# Altium project rtm-lamp.PrjPcb (part 5 of 6)

## Sheet power-amplifiers.SchDoc: Power Amplifiers
size A3; DrawnBy: Augusto Fraga Giachero; DocumentNumber: 5; SheetNumber: 5; SheetTotal: 9
Used 12 times, as channels CH11, CH10, CH9, CH8, CH0, CH1, CH2, CH3, CH4, CH5, CH6, CH7. Parts and nets are listed once, with the designators drawn on the sheet.
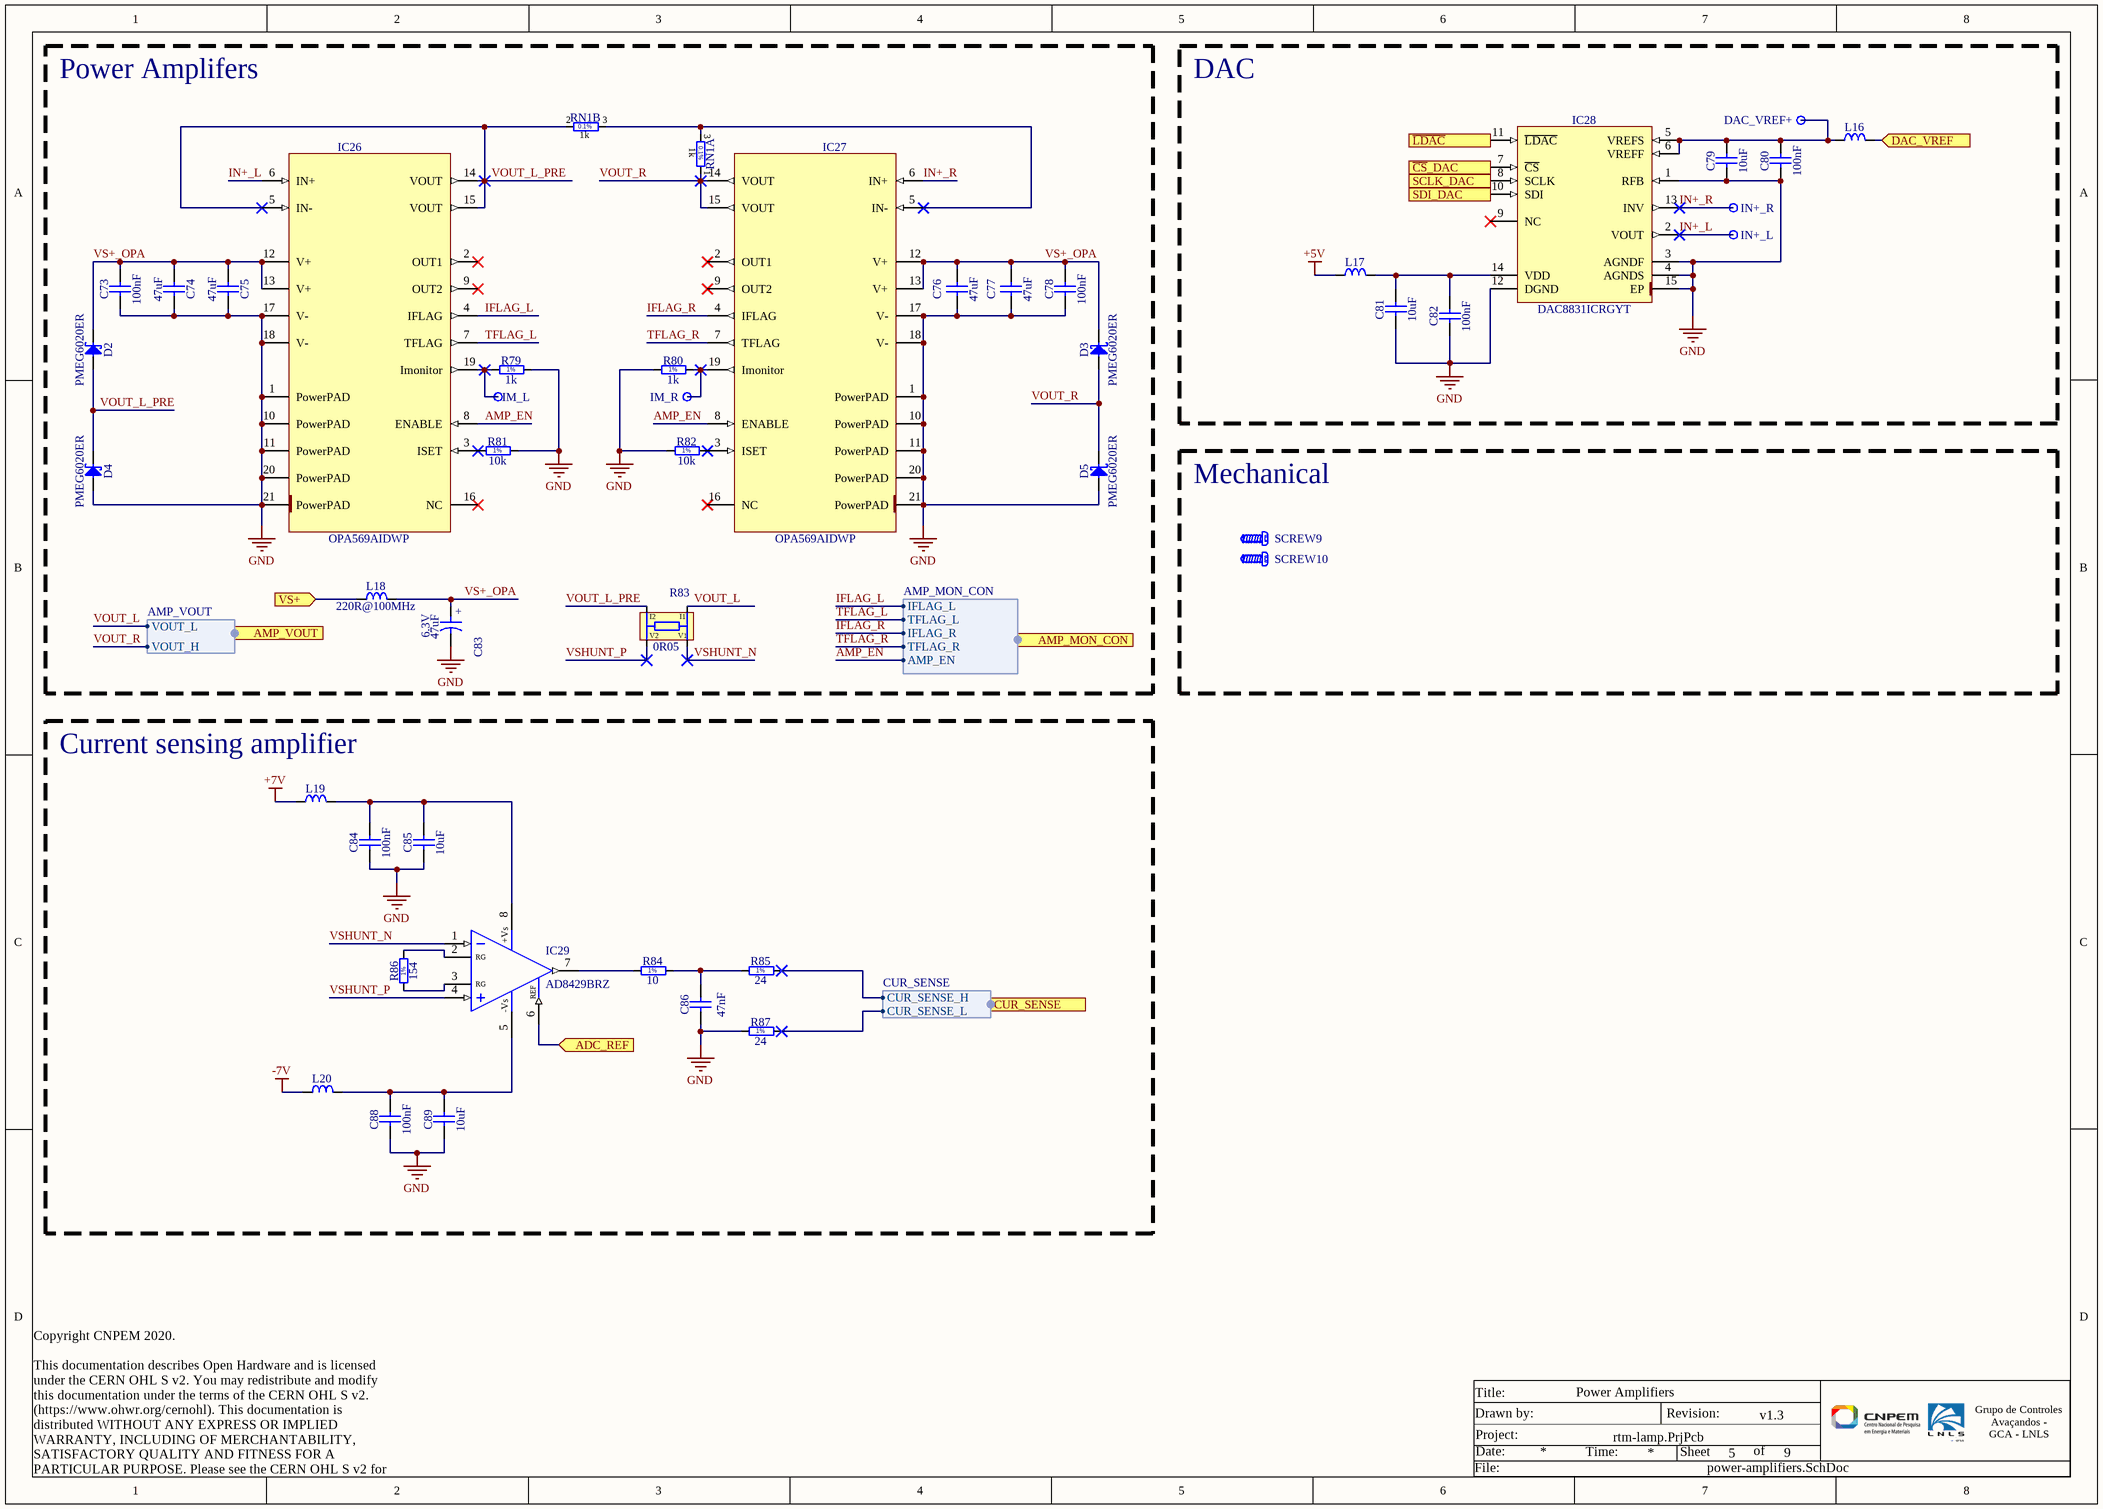
[diagram p6: power-amplifiers.SchDoc]

### Parts
C73  100nF  [CAPC1005X55N]
C74  47uF  [CAPC2012X140N]
C75  47uF  [CAPC2012X140N]
C76  47uF  [CAPC2012X140N]
C77  47uF  [CAPC2012X140N]
C78  100nF  [CAPC1005X55N]
C79  10uF  [CAPC2012X95N]
C80  100nF  [CAPC1005X55N]
C81  10uF  [CAPC2012X95N]
C82  100nF  [CAPC1005X55N]
C83  47uF  Voltage: 6.3V  [CAPMP3528X210N]
C84  100nF  [CAPC1608X87N]
C85  10uF  [CAPC2012X95N]
C86  47nF  [CAPC2012X135N]
C88  100nF  [CAPC1608X87N]
C89  10uF  [CAPC2012X95N]
D2  PMEG6020ER  [SODFL3517X110N]
D3  PMEG6020ER  [SODFL3517X110N]
D4  PMEG6020ER  [SODFL3517X110N]
D5  PMEG6020ER  [SODFL3517X110N]
DAC_VREF+  Test Point  [TPS127]  (value not drawn)
IC26  OPA569AIDWP  [SOIC127P1030X265-21N-R381X432-TB]
IC27  OPA569AIDWP  [SOIC127P1030X265-21N-R381X432-TB]
IC28  DAC8831ICRGYT  [TEXAS_RGY (S-PVQFN–N14) Simple]
IC29  AD8429BRZ  [SOIC127P600X175-8N]
IM_L  Test Point  [TPS127]  (value not drawn)
IM_R  Test Point  [TPS127]  (value not drawn)
IN+_L  Test Point  [TPS127]  (value not drawn)
IN+_R  Test Point  [TPS127]  (value not drawn)
L16  1K@100MHz  [INDC1608X95N]  (value not drawn)
L17  1K@100MHz  [INDC1608X95N]  (value not drawn)
L18  220R@100MHz  [INDC2012X105N]
L19  1K@100MHz  [INDC1608X95N]  (value not drawn)
L20  1K@100MHz  [INDC1608X95N]  (value not drawn)
R79  1k  [RESC1005X40N]
R80  1k  [RESC1005X40N]
R81  10k  [RESC1005X40N]
R82  10k  [RESC1005X40N]
R83  0R05  [RES_VISHAY_WSK1206]
R84  10  [RESC1005X40N]
R85  24  [RESC1005X40N]
R86  154  [RESC1608X55N]
R87  24  [RESC1005X40N]
RN1  1k 1k  [SOT95P230X112-3N]  (value not drawn)  (parts A,B of 2)
SCREW9  M2x6  [MCMASTERCARR_90910A922_V]  (value not drawn)
SCREW10  M2x6  [MCMASTERCARR_90910A922_V]  (value not drawn)

### Blocks framed on the sheet
Power Amplifers: C73-C78 C83 D2-D5 IC26 IC27 IM_L IM_R L18 R79-R83 RN1
DAC: C79-C82 DAC_VREF+ IC28 IN+_L IN+_R L16 L17
Mechanical: SCREW9 SCREW10
Current sensing amplifier: C84-C86 C88 C89 IC29 L19 L20 R84-R87

### Ports
ADC_REF (in), AMP_MON_CON (harness AMP_MON_CON), AMP_VOUT (harness AMP_VOUT), CUR_SENSE (harness CUR_SENSE), DAC_VREF (in), SCLK_DAC (in), SDI_DAC (in), VS+ (in), ~{CS}_DAC (in), ~{LDAC} (in)

### Harnesses
AMP_MON_CON: IFLAG_L, TFLAG_L, IFLAG_R, TFLAG_R, AMP_EN
AMP_VOUT: VOUT_L, VOUT_H
CUR_SENSE: CUR_SENSE_H, CUR_SENSE_L

### Nets
+5V: L17.1
+7V: L19.1
-7V: L20.1
GND: C73.1 C74.1 C75.1 C76.1 C77.1 C78.1 C79.1 C80.1 C81.1 C82.1 C83.2 C84.1 C85.1 C86.1 C88.1 C89.1 D4.2(A) D5.2(A) IC26.1(PowerPAD) IC26.10(PowerPAD) IC26.11(PowerPAD) IC26.17(V-) IC26.18(V-) IC26.20(PowerPAD) IC26.21(PowerPAD) IC27.1(PowerPAD) IC27.10(PowerPAD) IC27.11(PowerPAD) IC27.17(V-) IC27.18(V-) IC27.20(PowerPAD) IC27.21(PowerPAD) IC28.1(RFB) IC28.3(AGNDF) IC28.4(AGNDS) IC28.12(DGND) IC28.15(EP) R79.2 R80.1 R81.2 R82.1 R87.1
ADC_REF: IC29.6(REF) ; port ADC_REF
AMP_EN: IC26.8(ENABLE) IC27.8(ENABLE) ; port AMP_MON_CON.AMP_EN
~{CS}_DAC: IC28.7(~{CS}) ; port ~{CS}_DAC
DAC_VREF: L16.2 ; port DAC_VREF
IFLAG_L: IC26.4(IFLAG) ; port AMP_MON_CON.IFLAG_L
IFLAG_R: IC27.4(IFLAG) ; port AMP_MON_CON.IFLAG_R
IN+_L: IC26.6(IN+) IC28.2(VOUT) IN+_L.1
IN+_R: IC27.6(IN+) IC28.13(INV) IN+_R.1
~{LDAC}: IC28.11(~{LDAC}) ; port ~{LDAC}
SCLK_DAC: IC28.8(SCLK) ; port SCLK_DAC
SDI_DAC: IC28.10(SDI) ; port SDI_DAC
TFLAG_L: IC26.7(TFLAG) ; port AMP_MON_CON.TFLAG_L
TFLAG_R: IC27.7(TFLAG) ; port AMP_MON_CON.TFLAG_R
VOUT_L: R83.I1 ; port AMP_VOUT.VOUT_L
VOUT_L_PRE: D2.2(A) D4.1(C) IC26.5(IN-) IC26.14(VOUT) IC26.15(VOUT) R83.I2 RN1.2
VOUT_R: D3.2(A) D5.1(C) IC27.14(VOUT) IC27.15(VOUT) RN1.1 ; port AMP_VOUT.VOUT_H
VS+: L18.1 ; port VS+
VS+_OPA: C73.2 C74.2 C75.2 C76.2 C77.2 C78.2 C83.1 D2.1(C) D3.1(C) IC26.12(V+) IC26.13(V+) IC27.12(V+) IC27.13(V+) L18.2
VSHUNT_N: IC29.1(-IN) R83.V1
VSHUNT_P: IC29.4(+IN) R83.V2
NetC79_2: C79.2 C80.2 DAC_VREF+.1 IC28.5(VREFS) IC28.6(VREFF) L16.1
NetC81_2: C81.2 C82.2 IC28.14(VDD) L17.2
NetC84_2: C84.2 C85.2 IC29.8(+Vs) L19.2
NetC86_2: C86.2 R84.2 R85.1
NetC88_2: C88.2 C89.2 IC29.5(-Vs) L20.2
NetIC26_3: IC26.3(ISET) R81.1
NetIC26_19: IC26.19(Imonitor) IM_L.1 R79.1
NetIC27_3: IC27.3(ISET) R82.2
NetIC27_5: IC27.5(IN-) RN1.3
NetIC27_19: IC27.19(Imonitor) IM_R.1 R80.2
NetIC29_2: IC29.2(RG) R86.2
NetIC29_3: IC29.3(RG) R86.1
NetIC29_7: IC29.7(Vout) R84.1
NetR85_2: R85.2 ; port CUR_SENSE.CUR_SENSE_H
NetR87_2: R87.2 ; port CUR_SENSE.CUR_SENSE_L

Not connected (* = marked no-connect by the designer): IC26 2(OUT1)* 9(OUT2)* 16(NC)*; IC27 2(OUT1)* 9(OUT2)* 16(NC)*; IC28 9(NC)*

### Channels
CH11: designators end in _CH11; ports ADC_REF=ADC_REF_CH8-CH11 DAC_VREF=DAC_REF_CH8-CH11 SCLK_DAC=CLK_DAC_B2 SDI_DAC=SDI_DAC_CH11 VS+=+VS2 ~{CS}_DAC=~{CS_DAC_B2} ~{LDAC}=~{LDAC_B2}
CH10: designators end in _CH10; ports ADC_REF=ADC_REF_CH8-CH11 DAC_VREF=DAC_REF_CH8-CH11 SCLK_DAC=CLK_DAC_B2 SDI_DAC=SDI_DAC_CH10 VS+=+VS2 ~{CS}_DAC=~{CS_DAC_B2} ~{LDAC}=~{LDAC_B2}
CH9: designators end in _CH9; ports ADC_REF=ADC_REF_CH8-CH11 DAC_VREF=DAC_REF_CH8-CH11 SCLK_DAC=CLK_DAC_B2 SDI_DAC=SDI_DAC_CH9 VS+=+VS2 ~{CS}_DAC=~{CS_DAC_B2} ~{LDAC}=~{LDAC_B2}
CH8: designators end in _CH8; ports ADC_REF=ADC_REF_CH8-CH11 DAC_VREF=DAC_REF_CH8-CH11 SCLK_DAC=CLK_DAC_B2 SDI_DAC=SDI_DAC_CH8 VS+=+VS2 ~{CS}_DAC=~{CS_DAC_B2} ~{LDAC}=~{LDAC_B2}
CH0: designators end in _CH0; ports ADC_REF=ADC_REF_CH0-CH7 DAC_VREF=DAC_REF_CH0-CH7 SCLK_DAC=CLK_DAC_B0 SDI_DAC=SDI_DAC_CH0 VS+=+VS1 ~{CS}_DAC=~{CS_DAC_B0} ~{LDAC}=~{LDAC_B0}
CH1: designators end in _CH1; ports ADC_REF=ADC_REF_CH0-CH7 DAC_VREF=DAC_REF_CH0-CH7 SCLK_DAC=CLK_DAC_B0 SDI_DAC=SDI_DAC_CH1 VS+=+VS1 ~{CS}_DAC=~{CS_DAC_B0} ~{LDAC}=~{LDAC_B0}
CH2: designators end in _CH2; ports ADC_REF=ADC_REF_CH0-CH7 DAC_VREF=DAC_REF_CH0-CH7 SCLK_DAC=CLK_DAC_B0 SDI_DAC=SDI_DAC_CH2 VS+=+VS1 ~{CS}_DAC=~{CS_DAC_B0} ~{LDAC}=~{LDAC_B0}
CH3: designators end in _CH3; ports ADC_REF=ADC_REF_CH0-CH7 DAC_VREF=DAC_REF_CH0-CH7 SCLK_DAC=CLK_DAC_B0 SDI_DAC=SDI_DAC_CH3 VS+=+VS1 ~{CS}_DAC=~{CS_DAC_B0} ~{LDAC}=~{LDAC_B0}
CH4: designators end in _CH4; ports ADC_REF=ADC_REF_CH0-CH7 DAC_VREF=DAC_REF_CH0-CH7 SCLK_DAC=CLK_DAC_B1 SDI_DAC=SDI_DAC_CH4 VS+=+VS1 ~{CS}_DAC=~{CS_DAC_B1} ~{LDAC}=~{LDAC_B1}
CH5: designators end in _CH5; ports ADC_REF=ADC_REF_CH0-CH7 DAC_VREF=DAC_REF_CH0-CH7 SCLK_DAC=CLK_DAC_B1 SDI_DAC=SDI_DAC_CH5 VS+=+VS1 ~{CS}_DAC=~{CS_DAC_B1} ~{LDAC}=~{LDAC_B1}
CH6: designators end in _CH6; ports ADC_REF=ADC_REF_CH0-CH7 DAC_VREF=DAC_REF_CH0-CH7 SCLK_DAC=CLK_DAC_B1 SDI_DAC=SDI_DAC_CH6 VS+=+VS1 ~{CS}_DAC=~{CS_DAC_B1} ~{LDAC}=~{LDAC_B1}
CH7: designators end in _CH7; ports ADC_REF=ADC_REF_CH0-CH7 DAC_VREF=DAC_REF_CH0-CH7 SCLK_DAC=CLK_DAC_B1 SDI_DAC=SDI_DAC_CH7 VS+=+VS1 ~{CS}_DAC=~{CS_DAC_B1} ~{LDAC}=~{LDAC_B1}

### Notes on the sheet
- Title:
- Date:
- Project:
- Drawn by:
- Time:
- Revision:
- Sheet
- of
- Grupo de Controles Avaçandos -
  GCA - LNLS
- Copyright CNPEM 2020.
  This documentation describes Open Hardware and is licensed under the CERN OHL S v2. You may redistribute and modify this documentation under the terms of the CERN OHL S v2. (https://www.ohwr.org/cernohl). This documentation is distributed WITHOUT ANY EXPRESS OR IMPLIED WARRANTY, INCLUDING OF MERCHANTABILITY, SATISFACTORY QUALITY AND FITNESS FOR A PARTICULAR PURPOSE. Please see the CERN OHL S v2 for applicable conditions.
- File:
- (in symbol CTE3528-21_47UF_6.3V_10%_LESR0250) +
- (in symbol MPM2001AT1, part A) 1k; 0.1%
- (in symbol MPM2001AT1, part B) 0.1%; 1k
- (in symbol R0402_1K_1%_0.0625W_100PPM) 1%
- (in symbol R0402_10K_1%_0.0625W_100PPM) 1%
- (in symbol R0402_10R_1%_0.0625W_200PPM) 1%
- (in symbol R0402_24R_1%_0.0625W_100PPM) 1%
- (in symbol R0603_154R_1%_0.063W_10PPM) 1%

### Library data of the parts
C73 C78 C80 C82 = CC0402_100NF_16V_10%_X7R: SMD Multilayer Chip Ceramic Capacitor; Manufacturer: GENERIC; Manufacturer1 Part Number: GRM155R71C104KA88D; Voltage: 16V; TC: X7R; Tolerance: ±10%; Part Number: CC0402_100NF_16V_10%_X7R; Component Kind: Standard; Component Type: Standard; Pin Count: 2; Value: 100nF; Status: Not Recommended; Manufacturer Part Number: CC0402_100NF_16V_10%_X7R; Case: 0402; Mounted: Yes; Socket: No; SMD: Yes; Sense: No; Manufacturer1 Example: MURATA; Manufacturer1 ComponentHeight: 0.55mm; HelpURL: \\cern.ch\dfs\Applications\Altium\Datasheets\CC0402_X7R_MURATA_GRM.pdf; Author: CERN DEM JLC; CreateDate: 05/12/2013; LatestRevisionDate: 03/12/2007
C74-C77 = CC0805_47UF_6.3V_20%_X5R: SMD Multilayer Chip Ceramic Capacitor; Manufacturer: GENERIC; Manufacturer1 Part Number: C0805C476M9PACTU; Voltage: 6.3V; TC: X5R; Tolerance: ±20%; Part Number: CC0805_47UF_6.3V_20%_X5R; Component Kind: Standard; Component Type: Standard; Pin Count: 2; Value: 47uF; Status: Preferred; Manufacturer Part Number: CC0805_47UF_6.3V_20%_X5R; Case: 0805; Mounted: Yes; Socket: No; SMD: Yes; Sense: No; Manufacturer1 Example: KEMET; Manufacturer1 ComponentHeight: 1.4mm; HelpURL: \\cern.ch\dfs\Applications\Altium\Datasheets\CC0805_X5R_KEMET.pdf; Author: CERN DEM JLC; CreateDate: 16/10/2012; LatestRevisionDate: 16/10/2012
C79 C81 C85 C89 = CC0805_10UF_25V_10%_X5R: SMD Multilayer Chip Ceramic Capacitor; Manufacturer: GENERIC; Manufacturer1 Part Number: GRM219R61E106KA12D; Voltage: 25V; TC: X5R; Tolerance: ±10%; Part Number: CC0805_10UF_25V_10%_X5R; Component Kind: Standard; Component Type: Standard; Pin Count: 2; Value: 10uF; Status: Preferred; Manufacturer Part Number: CC0805_10UF_25V_10%_X5R; Case: 0805; Mounted: Yes; Socket: No; SMD: Yes; Sense: No; Manufacturer1 Example: MURATA; Manufacturer1 ComponentHeight: 0.95mm; HelpURL: \\cern.ch\dfs\Applications\Altium\Datasheets\CC0805_X5R_MURATA_GRM.pdf; Author: CERN DEM JLC; CreateDate: 25/10/2012; LatestRevisionDate: 06/09/2016
C83 = CTE3528-21_47UF_6.3V_10%_LESR0250: Low ESR 0R25 Solid Tantalum Chip Capacitor; Manufacturer: GENERIC; Manufacturer1 Part Number: TPSB476K006R0250; Tolerance: ±10%; Part Number: CTE3528-21_47UF_6.3V_10%_LESR0250; Component Kind: Standard; Component Type: Standard; Pin Count: 2; Value: 47uF; Status: Preferred; Manufacturer Part Number: CTE3528-21_47UF_6.3V_10%_LESR0250; Case: B; Mounted: Yes; Socket: No; SMD: Yes; Sense: No; Manufacturer1 Example: AVX; Manufacturer1 ComponentHeight: 2.1mm; HelpURL: \\cern.ch\dfs\Applications\Altium\Datasheets\CTE-LESR_AVX_TPS.pdf; Author: CERN DEM JLC; CreateDate: 05/05/2008; LatestRevisionDate: 20/01/2009
C84 C88 = CC0603_100NF_50V_10%_X7R: SMD Multilayer Chip Ceramic Capacitor; Manufacturer: GENERIC; Manufacturer1 Part Number: 223858615649; Voltage: 50V; TC: X7R; Tolerance: ±10%; Part Number: CC0603_100NF_50V_10%_X7R; Component Kind: Standard; Component Type: Standard; Pin Count: 2; Value: 100nF; Status: Preferred; Manufacturer Part Number: CC0603_100NF_50V_10%_X7R; Case: 0603; Mounted: Yes; Socket: No; SMD: Yes; Sense: No; Manufacturer1 Example: PHYCOMP; Manufacturer1 ComponentHeight: 0.87mm; HelpURL: \\cern.ch\dfs\Applications\Altium\Datasheets\CC0603_X7R_PHYCOMP.pdf; Author: CERN DEM JLC; CreateDate: 03/12/2007; LatestRevisionDate: 03/12/2007
C86 = CC0805_47NF_25V_5%_C0G_KEMET_C0805X473J3GECAUTO: SMD Multilayer Chip Ceramic Capacitor, C0G dielectric, Flexible termination; Manufacturer: KEMET; Voltage: 25V; Tolerance: ±5%; Part Number: CC0805_47NF_25V_5%_C0G_KEMET_C0805X473J3GECAUTO; Component Kind: Standard; Component Type: Standard; Pin Count: 2; Value: 47nF; Status: None; TC: C0G; Manufacturer Part Number: C0805X473J3GECAUTO; Case: 0805; Mounted: Yes; Socket: No; SMD: Yes; Sense: No; ComponentHeight: 1.25mm; Author: LNLS DIG AFG; CreateDate: 16/10/2020; LatestRevisionDate: 16/10/2020
D2-D5 = PMEG6020ER: MEGA Schottky Barrier Rectifier; Manufacturer: NXP SEMICONDUCTORS; Voltage: 60V; Power: 2A; PressFit: No; Bonding: No; Part Number: PMEG6020ER; Component Kind: Standard; Component Type: Standard; Device: PMEG6020ER; PackageDescription: SODFL Diode (SOD123W); 2.60mm W X 1.70mm L X 1.10mm H body, IPC Medium Density; Manufacturer Part Number: PMEG6020ER; Pin Count: 2; Case: SOD123; Mounted: Yes; Socket: No; SMD: Yes; Sense: No; ComponentHeight: 0.65mm; HelpURL: \\cern.ch\dfs\Applications\Altium\Datasheets\PMEG6020ER.pdf; Author: CERN DEM JMW; CreateDate: 19/06/2014; LatestRevisionDate: 19/06/2014
DAC_VREF+ IM_L IM_R IN+_L IN+_R = SMD_PAD_1.27X1.27MM: 1.27mm x 1.27mm PCB Copper Area (SMD Test Point); Mounted: No; Part Number: SMD_PAD_1.27X1.27MM; Component Kind: Standard (No BOM); Component Type: Standard (No BOM); Pin Count: 1; Family: Test Point; Socket: No; SMD: Yes; Sense: No; Status: None; ComponentHeight: 0mm; HelpURL: Undefined; Author: CERN DEM JLC; CreateDate: 12/01/2008; LatestRevisionDate: 12/01/2008; PackageDescription: 1.27mm x 1.27mm PCB Copper Area (SMD Test Point)
IC26 IC27 = OPA569AIDWP_HEATSINK: Rail-to-Rail I/O, 2A, Power amplifier; Manufacturer: TEXAS INSTRUMENTS; PressFit: No; Bonding: No; Part Number: OPA569AIDWP_HEATSINK; Component Kind: Standard; Component Type: Standard; Device: OPA569AIDWP; PackageDescription: SOIC 20, Pitch 1.27mm - Body 7.5x12.9mm, (w/thermal tab 3.81mm X 4.32mm), IPC Medium Density; Manufacturer Part Number: OPA569AIDWP; Pin Count: 21; Case: SOIC20; Mounted: Yes; Socket: No; SMD: Yes; Sense: No; ComponentHeight: 2.65mm; Author: LNLS DIG AFG; CreateDate: 12/07/2020; LatestRevisionDate: 12/07/2020
IC28 = DAC8831ICRGYT: 16-Bit, Ultra-Low Power, Voltage-Output Digital-to-Analog Converter; Manufacturer: TEXAS INSTRUMENTS; PressFit: No; Bonding: No; Part Number: DAC8831ICRGYT; Component Kind: Standard; Component Type: Standard; Device: DAC8831ICRGYT; Footprint: TEXAS_RGY (S-PVQFN–N14); PackageDescription: TEXAS Case Style RGY (S-PVQFN-N14), QFN, 0.50mm Pitch, Square; 14 Pin, 3.5mm L X 3.5mm W X 1.00mm H body (w/thermal tab 2.15 X 2.15mm); Manufacturer Part Number: DAC8831ICRGYT; Pin Count: 15; Case: QFN14; Mounted: Yes; Socket: No; SMD: Yes; Sense: No; ComponentHeight: 1mm; Author: LNLS DIG LOS; CreateDate: 13/06/2018; LatestRevisionDate: 20/12/2021
IC29 = AD8429BRZ: 1nV/sqrt Hz Low Noise Instrumentation Amplifier; Manufacturer: ANALOG DEVICES; PressFit: No; Bonding: No; Part Number: AD8429BRZ; Component Kind: Standard; Component Type: Standard; Device: AD8429BRZ; PackageDescription: SOIC 8, Pitch 1.27mm - Body 4x5mm, IPC Medium Density; Manufacturer Part Number: AD8429BRZ; Pin Count: 8; Case: SOIC8; Mounted: Yes; Socket: No; SMD: Yes; Sense: No; ComponentHeight: 1.75mm; Author: CERN DEM JLC; HelpURL: \\cern.ch\dfs\Applications\Altium\Datasheets\AD8429BRZ.pdf; CreateDate: 31/08/2011; LatestRevisionDate: 31/08/2011
L16 L17 L19 L20 = IND0603_MURATA_BLM18AG102SN1D: SMD EMIFIL Suppression Chip Ferrite Bead; Manufacturer: MURATA; Power: 400mA; Resistance: 0.50R; Tolerance: ±25%; Part Number: IND0603_MURATA_BLM18AG102SN1D; Component Kind: Standard; Component Type: Standard; Pin Count: 2; Value: 1K@100MHz; Status: None; Manufacturer Part Number: BLM18AG102SN1D; Case: 0603; Mounted: Yes; Socket: No; SMD: Yes; Sense: No; ComponentHeight: 0.95mm; Author: LNLS DIG GBMB; CreateDate: 03/11/2017; LatestRevisionDate: 03/11/2017
L18 = IND0805_MURATA_BLM21PG221SN1D: SMD EMIFIL Suppression Chip Ferrite Bead; Manufacturer: MURATA; Power: 2A; Resistance: 0.05R; Tolerance: ±25%; Part Number: IND0805_MURATA_BLM21PG221SN1D; Component Kind: Standard; Component Type: Standard; Pin Count: 2; Value: 220R@100MHz; Status: None; Manufacturer Part Number: BLM21PG221SN1D; Case: 0805; Mounted: Yes; Socket: No; SMD: Yes; Sense: No; ComponentHeight: 1.05mm; HelpURL: \\cern.ch\dfs\Applications\Altium\Datasheets\IND0402_MURATA_BLM21P.pdf; Author: CERN DEM JLC; CreateDate: 25/01/2010; LatestRevisionDate: 25/01/2010
R79 R80 = R0402_1K_1%_0.0625W_100PPM: General Purpose Thick Film Chip Resistor; Manufacturer: GENERIC; Manufacturer1 Part Number: 232270671002L; TC: ±100ppm/°C; Tolerance: ±1%; Part Number: R0402_1K_1%_0.0625W_100PPM; Component Kind: Standard; Component Type: Standard; Pin Count: 2; Value: 1k; Status: Not recommended; Power: 0.0625W; Manufacturer Part Number: R0402_1K_1%_0.0625W_100PPM; Case: 0402; Mounted: Yes; Sense: No; Socket: No; SMD: Yes; Manufacturer1 Example: YAGEO PHYCOMP; Manufacturer1 ComponentHeight: 0.4mm; HelpURL: \\cern.ch\dfs\Applications\Altium\Datasheets\R0402_Phycomp_RC0402.pdf; Author: CERN DEM JLC; CreateDate: 03/12/2007; LatestRevisionDate: 17/10/2012
R81 R82 = R0402_10K_1%_0.0625W_100PPM: General Purpose Thick Film Chip Resistor; Manufacturer: GENERIC; Manufacturer1 Part Number: 232270671003L; TC: ±100ppm/°C; Tolerance: ±1%; Part Number: R0402_10K_1%_0.0625W_100PPM; Component Kind: Standard; Component Type: Standard; Pin Count: 2; Value: 10k; Status: Not recommended; Power: 0.0625W; Manufacturer Part Number: R0402_10K_1%_0.0625W_100PPM; Case: 0402; Mounted: Yes; Sense: No; Socket: No; SMD: Yes; Manufacturer1 Example: YAGEO PHYCOMP; Manufacturer1 ComponentHeight: 0.4mm; HelpURL: \\cern.ch\dfs\Applications\Altium\Datasheets\R0402_Phycomp_RC0402.pdf; Author: CERN DEM JLC; CreateDate: 03/12/2007; LatestRevisionDate: 17/10/2012
R83 = R1206_0R05_1%_0.5W_35PPM_VISHAY: Four Terminal Current Sense; Manufacturer: Vishay; Manufacturer Part Number: WSK1206R0500FEA18; Power: 0.5W; TC: ±35ppm/°C; Tolerance: ±1%; Part Number: R1206_0R05_1%_0.5W_35PPM_VISHAY; Component Kind: Standard; Component Type: Standard; Pin Count: 4; Value: 0R05; Status: None; Case: WSK1206; Mounted: Yes; Sense: No; Socket: No; SMD: Yes; ComponentHeight: 0.7mm; Author: LNLS DIG GBMB; CreateDate: 05/11/2018; LatestRevisionDate: 05/11/2018
R84 = R0402_10R_1%_0.0625W_200PPM: General Purpose Thick Film Chip Resistor; Manufacturer: GENERIC; Manufacturer1 Part Number: 232270671009L; TC: ±200ppm/°C; Tolerance: ±1%; Part Number: R0402_10R_1%_0.0625W_200PPM; Component Kind: Standard; Component Type: Standard; Pin Count: 2; Value: 10; Status: Not recommended; Power: 0.0625W; Manufacturer Part Number: R0402_10R_1%_0.0625W_200PPM; Case: 0402; Mounted: Yes; Sense: No; Socket: No; SMD: Yes; Manufacturer1 Example: YAGEO PHYCOMP; Manufacturer1 ComponentHeight: 0.4mm; HelpURL: \\cern.ch\dfs\Applications\Altium\Datasheets\R0402_Phycomp_RC0402.pdf; Author: CERN DEM JLC; CreateDate: 24/06/2009; LatestRevisionDate: 17/10/2012
R85 R87 = R0402_24R_1%_0.0625W_100PPM: General Purpose Thick Film Chip Resistor; Manufacturer: GENERIC; Manufacturer1 Part Number: 232270672409L; TC: ±100ppm/°C; Tolerance: ±1%; Part Number: R0402_24R_1%_0.0625W_100PPM; Component Kind: Standard; Component Type: Standard; Pin Count: 2; Value: 24; Status: Not recommended; Power: 0.0625W; Manufacturer Part Number: R0402_24R_1%_0.0625W_100PPM; Case: 0402; Mounted: Yes; Sense: No; Socket: No; SMD: Yes; Manufacturer1 Example: YAGEO PHYCOMP; Manufacturer1 ComponentHeight: 0.4mm; HelpURL: \\cern.ch\dfs\Applications\Altium\Datasheets\R0402_Phycomp_RC0402.pdf; Author: CERN DEM JLC; CreateDate: 03/12/2007; LatestRevisionDate: 17/10/2012
R86 = R0603_154R_1%_0.063W_10PPM: General Purpose Thick Film Chip Resistor; Manufacturer: GENERIC; Manufacturer Part Number: R0603_154R_1%_0.1W_100PPM; Manufacturer1 Part Number: RC0603FR-07154RL; Power: 0.1W; TC: ±100ppm; Tolerance: ±1%; Part Number: R0603_154R_1%_0.063W_10PPM; Component Kind: Standard; Component Type: Standard; Pin Count: 2; Value: 154; Case: 0603; Mounted: Yes; Sense: No; Socket: No; SMD: Yes; Manufacturer1 Example: YAGEO PHYCOMP; Manufacturer1 ComponentHeight: 0.6mm; Author: LNLS DIG GBMB; CreateDate: 05/11/2018; LatestRevisionDate: 05/11/2018
RN1 = MPM2001AT1: Divider, Thin Film Resistors Network; Manufacturer: VISHAY THIN FILM; Power: 0.1W; TC: ±25ppm/°C; Tolerance: ±0.1%; Voltage: 100V; Part Number: MPM2001AT1; Component Kind: Standard; Component Type: Standard; Pin Count: 3; Value: 1k 1k; Sense: no; Manufacturer Part Number: MPM2001AT1; Case: SOT23-3; Mounted: Yes; Socket: No; SMD: Yes; ComponentHeight: 1.22mm; HelpURL: \\cern.ch\dfs\Applications\Altium\Datasheets\RN_VISHAY_MPM.pdf; Author: LNLS DIG AFG; CreateDate: 11/05/2020; LatestRevisionDate: 11/05/2020
SCREW9 SCREW10 = MCMASTERCARR_90910A922_v: M2 L=6mm Torx Socket Pan Head Screw, Fully Threaded - Stainless Steel; Manufacturer: MCMASTER-CARR; PressFit: No; Part Number: MCMASTERCARR_90910A922_v; Component Kind: Standard; Component Type: Mechanical; Pin Count: 0; PackageDescription: M2 L=6mm Hexalobular Socket Pan Head Screw, Fully Threaded - Stainless Steel; Mounted: Yes; Socket: No; SMD: No; Sense: No; Status: None; Value: M2x6; Manufacturer Part Number: 90910A922; ComponentHeight: 7.1mm; Author: LNLS DIG AFG; CreateDate: 05/08/2020; LatestRevisionDate: 05/08/2020

## Sheet clock-distribution.SchDoc: Clock Distribution
size A3; DrawnBy: Augusto Fraga Giachero; DocumentNumber: 8; SheetNumber: 8; SheetTotal: 9
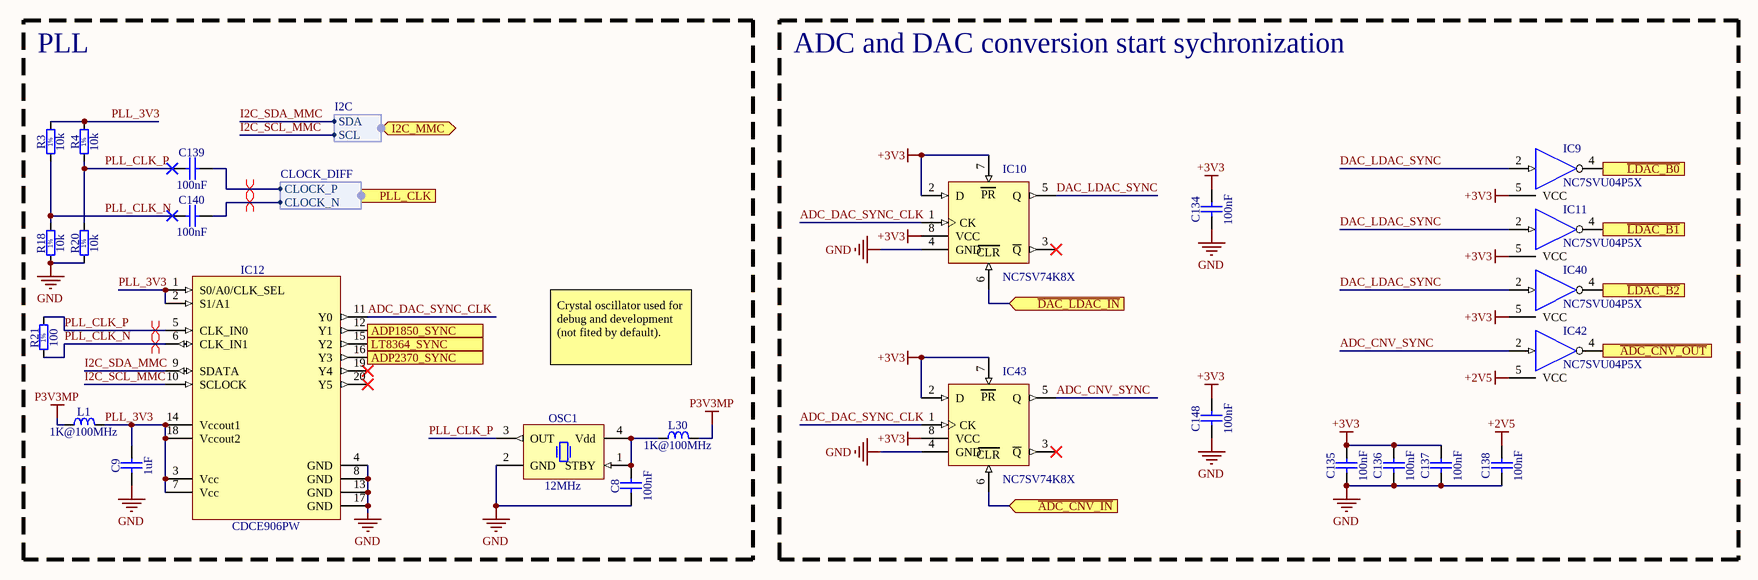
[diagram p7: clock-distribution.SchDoc]

### Parts
C8  100nF  [CAPC1005X55N]
C9  1uF  [CAPC2012X135N]
C134  100nF  [CAPC1005X55N]
C135  100nF  [CAPC1005X55N]
C136  100nF  [CAPC1005X55N]
C137  100nF  [CAPC1005X55N]
C138  100nF  [CAPC1005X55N]
C139  100nF  [CAPC1005X55N]
C140  100nF  [CAPC1005X55N]
C148  100nF  [CAPC1005X55N]
IC9  NC7SVU04P5X  [SOT65P210X110-5N]
IC10  NC7SV74K8X  [SOP50P310X90-8N]
IC11  NC7SVU04P5X  [SOT65P210X110-5N]
IC12  CDCE906PW  [SOP65P640X120-20N]
IC40  NC7SVU04P5X  [SOT65P210X110-5N]
IC42  NC7SVU04P5X  [SOT65P210X110-5N]
IC43  NC7SV74K8X  [SOP50P310X90-8N]
L1  1K@100MHz  [INDC1608X95N]
L30  1K@100MHz  [INDC1608X95N]
OSC1  12MHz  [XTAL_CONNOR_CS_LNLS]
R3  10k  [RESC1005X40N]
R4  10k  [RESC1005X40N]
R18  10k  [RESC1005X40N]
R20  10k  [RESC1005X40N]
R21  100  [RESC1005X40N]

### Blocks framed on the sheet
PLL: C8 C9 C139 C140 IC12 L1 L30 OSC1 R3 R4 R18 R20 R21
ADC and DAC conversion start sychronization: C134-C138 C148 IC9-IC11 IC40 IC42 IC43

### Ports
ADP1850_SYNC (out), ADP2370_SYNC (out), I2C_MMC (bidir, harness I2C), LT8364_SYNC (out), PLL_CLK (harness CLOCK_DIFF), ~{ADC_CNV_IN} (in), ~{ADC_CNV_OUT} (out), ~{DAC_LDAC_IN} (in), ~{LDAC_B0} (out), ~{LDAC_B1} (out), ~{LDAC_B2} (out)

### Harnesses
I2C: SDA, SCL
CLOCK_DIFF: CLOCK_P, CLOCK_N

### Nets
+2V5: C138.2 IC42.5(VCC)
+3V3: C134.2 C135.2 C136.2 C137.2 C148.2 IC9.5(VCC) IC10.2(D) IC10.7(~{PR}) IC10.8(VCC) IC11.5(VCC) IC40.5(VCC) IC43.2(D) IC43.7(~{PR}) IC43.8(VCC)
GND: C8.1 C9.1 C134.1 C135.1 C136.1 C137.1 C138.1 C148.1 IC9.3(GND) IC10.4(GND) IC11.3(GND) IC12.4(GND) IC12.8(GND) IC12.13(GND) IC12.17(GND) IC40.3(GND) IC42.3(GND) IC43.4(GND) OSC1.2(GND) R18.1 R20.1
P3V3MP: L1.1 L30.2
~{ADC_CNV_IN}: IC43.6(~{CLR}) ; port ~{ADC_CNV_IN}
~{ADC_CNV_OUT}: IC42.4(OUT) ; port ~{ADC_CNV_OUT}
ADC_CNV_SYNC: IC42.2(IN) IC43.5(Q)
ADC_DAC_SYNC_CLK: IC10.1(CK) IC12.11(Y0) IC43.1(CK)
ADP1850_SYNC: IC12.12(Y1) ; port ADP1850_SYNC
ADP2370_SYNC: IC12.16(Y3) ; port ADP2370_SYNC
~{DAC_LDAC_IN}: IC10.6(~{CLR}) ; port ~{DAC_LDAC_IN}
DAC_LDAC_SYNC: IC9.2(IN) IC10.5(Q) IC11.2(IN) IC40.2(IN)
I2C_SCL_MMC: IC12.10(SCLOCK) ; port I2C_MMC.SCL
I2C_SDA_MMC: IC12.9(SDATA) ; port I2C_MMC.SDA
~{LDAC_B0}: IC9.4(OUT) ; port ~{LDAC_B0}
~{LDAC_B1}: IC11.4(OUT) ; port ~{LDAC_B1}
~{LDAC_B2}: IC40.4(OUT) ; port ~{LDAC_B2}
LT8364_SYNC: IC12.15(Y2) ; port LT8364_SYNC
PLL_3V3: C9.2 IC12.1(S0/A0/CLK_SEL) IC12.2(S1/A1) IC12.3(Vcc) IC12.7(Vcc) IC12.14(Vccout1) IC12.18(Vccout2) L1.2 R3.2 R4.2
PLL_CLK_N: C140.1 IC12.6(CLK_IN1) R3.1 R18.2 R21.1
PLL_CLK_P: C139.1 IC12.5(CLK_IN0) OSC1.3(OUT) R4.1 R20.2 R21.2
SYNC_CLK1_N: C140.2 ; port PLL_CLK.CLOCK_N
SYNC_CLK1_P: C139.2 ; port PLL_CLK.CLOCK_P
NetC8_2: C8.2 L30.1 OSC1.1(STBY) OSC1.4(Vdd)

Not connected (* = marked no-connect by the designer): IC10 3(~{Q})*; IC12 19(Y4)* 20(Y5)*; IC43 3(~{Q})*

### Layout directives
differential pair; differential pair class DIFF100: PLL_CLK_N, PLL_CLK_P, SYNC_CLK1_N, SYNC_CLK1_P

### Notes on the sheet
- Crystal oscillator used for debug and development (not fited by default).
- Title:
- Date:
- Project:
- Drawn by:
- Time:
- Revision:
- Sheet
- of
- Grupo de Controles Avaçandos -
  GCA - LNLS
- Copyright CNPEM 2020.
  This documentation describes Open Hardware and is licensed under the CERN OHL S v2. You may redistribute and modify this documentation under the terms of the CERN OHL S v2. (https://www.ohwr.org/cernohl). This documentation is distributed WITHOUT ANY EXPRESS OR IMPLIED WARRANTY, INCLUDING OF MERCHANTABILITY, SATISFACTORY QUALITY AND FITNESS FOR A PARTICULAR PURPOSE. Please see the CERN OHL S v2 for applicable conditions.
- File:
- (in symbol NC7SV74K8X) PR; CLR
- (in symbol R0402_10K_1%_0.0625W_100PPM) 1%
- (in symbol R0402_100R_1%_0.0625W_100PPM) 1%

### Library data of the parts
C8 C134-C140 C148 = CC0402_100NF_16V_10%_X7R: as C73 on sheet power-amplifiers; Part Number: CC0402_100NF_16V_10%_X7R; Component Kind: Standard; Component Type: Standard; Pin Count: 2; Value: 100nF; Status: Not Recommended; Manufacturer Part Number: CC0402_100NF_16V_10%_X7R; Case: 0402; Mounted: Yes; Socket: No; SMD: Yes; Sense: No; Manufacturer1 Example: MURATA; Manufacturer1 ComponentHeight: 0.55mm; HelpURL: \\cern.ch\dfs\Applications\Altium\Datasheets\CC0402_X7R_MURATA_GRM.pdf; Author: CERN DEM JLC; CreateDate: 05/12/2013; LatestRevisionDate: 03/12/2007
C9 = CC0805_1UF_16V_10%_X7R: SMD Multilayer Chip Ceramic Capacitor; Manufacturer: GENERIC; Manufacturer1 Part Number: C2012X7R1C105K125AA; Voltage: 16V; TC: X7R; Tolerance: ±10%; Part Number: CC0805_1UF_16V_10%_X7R; Component Kind: Standard; Component Type: Standard; Pin Count: 2; Value: 1uF; Status: Preferred; Manufacturer Part Number: CC0805_1UF_16V_10%_X7R; Case: 0805; Mounted: Yes; Socket: No; SMD: Yes; Sense: No; Manufacturer1 Example: TDK; Manufacturer1 ComponentHeight: 1.45mm; HelpURL: \\cern.ch\dfs\Applications\Altium\Datasheets\CC0805_X7R_TDK_C.pdf; Author: CERN DEM JLC; CreateDate: 03/12/2007; LatestRevisionDate: 22/04/2015
IC9 IC11 IC40 IC42 = NC7SVU04P5X: TinyLogic® ULP-A Unbuffered Inverter; Manufacturer: FAIRCHILD SEMICONDUCTOR; PressFit: No; Bonding: No; Part Number: NC7SVU04P5X; Component Kind: Standard; Component Type: Standard; Device: NC7SVU04P5X; PackageDescription: SOT353, SC70-5, SOT, 0.65mm Pitch, 5 pin, 1.25mm W X 2.00mm L X 1.10mm H, IPC Medium Density; Manufacturer Part Number: NC7SVU04P5X; Pin Count: 5; Case: SOT353; Mounted: Yes; Socket: No; SMD: Yes; Sense: No; ComponentHeight: 1.1mm; Author: LNLS DIG LOS; CreateDate: 06/06/2018; LatestRevisionDate: 06/06/2018
IC10 IC43 = NC7SV74K8X: TinyLogic® ULP-A D-Type Flip-Flop with Preset and Clear; Manufacturer: FAIRCHILD SEMICONDUCTOR; PressFit: No; Bonding: No; Part Number: NC7SV74K8X; Component Kind: Standard; Component Type: Standard; Device: NC7SV74K8X; PackageDescription: SOP, 0.50mm pitch; 8 pin, 2.30mm W X 2.00mm L X 0.90mm H body, PC Medium Density; Manufacturer Part Number: NC7SV74K8X; Pin Count: 8; Case: TSSOP8; Mounted: Yes; Socket: No; SMD: Yes; Sense: No; ComponentHeight: 0.9mm; Author: LNLS DIG LOS; CreateDate: 06/06/2018; LatestRevisionDate: 06/06/2018
IC12 = CDCE906PW: Programmable 3-PLL clock synthesizer / Multiplier / Divider; Manufacturer: TEXAS INSTRUMENTS; PressFit: No; Bonding: No; Part Number: CDCE906PW; Component Kind: Standard; Component Type: Standard; Device: CDCE906PW; PackageDescription: SOP, 20-Leads, Body 6.5x4.4mm, Pitch 0.65mm, IPC Medium Density; Manufacturer Part Number: CDCE906PW; Pin Count: 20; Case: TSSOP20; Mounted: Yes; Socket: No; SMD: Yes; Sense: No; ComponentHeight: 1.2mm; Author: LNLS DIG LOS; CreateDate: 25/01/2018; LatestRevisionDate: 05/10/2021
L1 L30 = IND0603_MURATA_BLM18AG102SN1D: as L16 on sheet power-amplifiers; Part Number: IND0603_MURATA_BLM18AG102SN1D; Component Kind: Standard; Component Type: Standard; Pin Count: 2; Value: 1K@100MHz; Status: None; Manufacturer Part Number: BLM18AG102SN1D; Case: 0603; Mounted: Yes; Socket: No; SMD: Yes; Sense: No; ComponentHeight: 0.95mm; Author: LNLS DIG GBMB; CreateDate: 03/11/2017; LatestRevisionDate: 03/11/2017
OSC1 = ASE-12-D-C-T: 3.3V CMOS SMD Crystal Oscillator; Manufacturer: ABRACON CORPORATION; PressFit: No; Bonding: No; Part Number: ASE-12-D-C-T; Component Kind: Standard; Component Type: Standard; PackageDescription: 4 Pins, 2.5x3.2mm, SMD Sealing Crystal, CS Serie; Value: 12MHz; Manufacturer Part Number: ASE-12-D-C-T; Pin Count: 4; Mounted: Yes; Socket: No; SMD: Yes; Sense: No; ComponentHeight: 1.2mm; Author: LNLS DIG LOS; CreateDate: 31/07/2017; LatestRevisionDate: 31/07/2017
R3 R4 R18 R20 = R0402_10K_1%_0.0625W_100PPM: as R81 on sheet power-amplifiers; Part Number: R0402_10K_1%_0.0625W_100PPM; Component Kind: Standard; Component Type: Standard; Pin Count: 2; Value: 10k; Status: Not recommended; Power: 0.0625W; Manufacturer Part Number: R0402_10K_1%_0.0625W_100PPM; Case: 0402; Mounted: Yes; Sense: No; Socket: No; SMD: Yes; Manufacturer1 Example: YAGEO PHYCOMP; Manufacturer1 ComponentHeight: 0.4mm; HelpURL: \\cern.ch\dfs\Applications\Altium\Datasheets\R0402_Phycomp_RC0402.pdf; Author: CERN DEM JLC; CreateDate: 03/12/2007; LatestRevisionDate: 17/10/2012
R21 = R0402_100R_1%_0.0625W_100PPM: General Purpose Thick Film Chip Resistor; Manufacturer: GENERIC; Manufacturer1 Part Number: 232270671001L; TC: ±100ppm/°C; Tolerance: ±1%; Part Number: R0402_100R_1%_0.0625W_100PPM; Component Kind: Standard; Component Type: Standard; Pin Count: 2; Value: 100; Status: Not recommended; Power: 0.0625W; Manufacturer Part Number: R0402_100R_1%_0.0625W_100PPM; Case: 0402; Mounted: Yes; Socket: No; SMD: Yes; Manufacturer1 Example: YAGEO PHYCOMP; Manufacturer1 ComponentHeight: 0.4mm; HelpURL: \\cern.ch\dfs\Applications\Altium\Datasheets\R0402_Phycomp_RC0402.pdf; Author: CERN DEM JLC; CreateDate: 03/12/2007; LatestRevisionDate: 17/10/2012; Sense: No

## Sheet output-connectors.SchDoc: Analog Output Connectors
size A3; DrawnBy: Augusto Fraga Giachero; DocumentNumber: 9; SheetNumber: 9; SheetTotal: 9
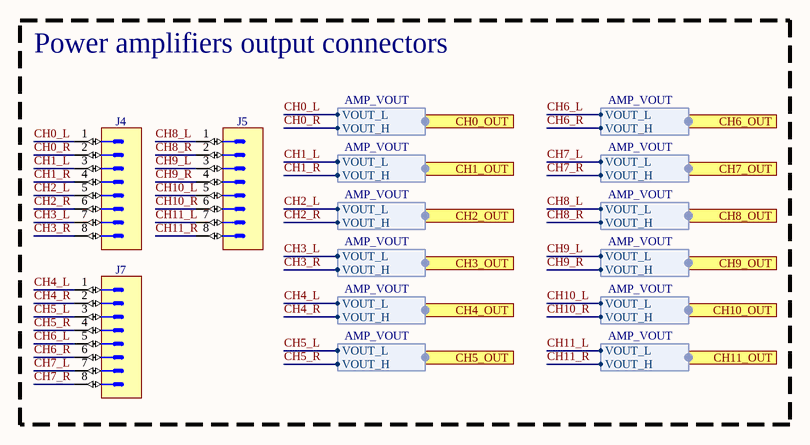
[diagram p8: output-connectors.SchDoc]

### Parts
J4  Euroblock  [MOLEX_39502-1008]  (value not drawn)
J5  Euroblock  [MOLEX_39502-1008]  (value not drawn)
J7  Euroblock  [MOLEX_39502-1008]  (value not drawn)

### Blocks framed on the sheet
Power amplifiers output connectors: J4 J5 J7

### Ports
CH0_OUT (harness AMP_VOUT), CH1_OUT (harness AMP_VOUT), CH2_OUT (harness AMP_VOUT), CH3_OUT (harness AMP_VOUT), CH4_OUT (harness AMP_VOUT), CH5_OUT (harness AMP_VOUT), CH6_OUT (harness AMP_VOUT), CH7_OUT (harness AMP_VOUT), CH8_OUT (harness AMP_VOUT), CH9_OUT (harness AMP_VOUT), CH10_OUT (harness AMP_VOUT), CH11_OUT (harness AMP_VOUT)

### Harnesses
AMP_VOUT: VOUT_L, VOUT_H

### Nets
CH0_L: J4.1 ; port CH0_OUT.VOUT_L
CH0_R: J4.2 ; port CH0_OUT.VOUT_H
CH1_L: J4.3 ; port CH1_OUT.VOUT_L
CH1_R: J4.4 ; port CH1_OUT.VOUT_H
CH2_L: J4.5 ; port CH2_OUT.VOUT_L
CH2_R: J4.6 ; port CH2_OUT.VOUT_H
CH3_L: J4.7 ; port CH3_OUT.VOUT_L
CH3_R: J4.8 ; port CH3_OUT.VOUT_H
CH4_L: J7.1 ; port CH4_OUT.VOUT_L
CH4_R: J7.2 ; port CH4_OUT.VOUT_H
CH5_L: J7.3 ; port CH5_OUT.VOUT_L
CH5_R: J7.4 ; port CH5_OUT.VOUT_H
CH6_L: J7.5 ; port CH6_OUT.VOUT_L
CH6_R: J7.6 ; port CH6_OUT.VOUT_H
CH7_L: J7.7 ; port CH7_OUT.VOUT_L
CH7_R: J7.8 ; port CH7_OUT.VOUT_H
CH8_L: J5.1 ; port CH8_OUT.VOUT_L
CH8_R: J5.2 ; port CH8_OUT.VOUT_H
CH9_L: J5.3 ; port CH9_OUT.VOUT_L
CH9_R: J5.4 ; port CH9_OUT.VOUT_H
CH10_L: J5.5 ; port CH10_OUT.VOUT_L
CH10_R: J5.6 ; port CH10_OUT.VOUT_H
CH11_L: J5.7 ; port CH11_OUT.VOUT_L
CH11_R: J5.8 ; port CH11_OUT.VOUT_H

### Notes on the sheet
- Title:
- Date:
- Project:
- Drawn by:
- Time:
- Revision:
- Sheet
- of
- Grupo de Controles Avaçandos -
  GCA - LNLS
- Copyright CNPEM 2020.
  This documentation describes Open Hardware and is licensed under the CERN OHL S v2. You may redistribute and modify this documentation under the terms of the CERN OHL S v2. (https://www.ohwr.org/cernohl). This documentation is distributed WITHOUT ANY EXPRESS OR IMPLIED WARRANTY, INCLUDING OF MERCHANTABILITY, SATISFACTORY QUALITY AND FITNESS FOR A PARTICULAR PURPOSE. Please see the CERN OHL S v2 for applicable conditions.
- File:

### Library data of the parts
J4 J5 J7 = MOLEX_39502-1008: 3.50mm Pitch Eurostyle Horizontal PCB Header, 8 Circuits; Manufacturer: MOLEX; Manufacturer Part Number: 395021008; PressFit: No; Part Number: MOLEX_39502-1008; Component Kind: Standard; Component Type: Standard; Pin Count: 8; Family: Euroblock; Mounted: Yes; Socket: No; SMD: No; Sense: No; Status: None; ComponentHeight: 6.9mm; Author: LNLS DIG AFG; CreateDate: 09/07/2020; LatestRevisionDate: 09/07/2020

## Nets that join several sheets
12P0V: rtm-connectors (J1.a1 J1.a2 J1.b1 J1.b2), power (F1.1 F2.1)
+2V5: rtm-connectors (L27.1), management-i2c (R36.1), power (5 pins), adc (L21.1 L23.1), clock-distribution (C138.2 IC42.5)
+3V3: rtm-connectors (L28.1 L29.2), management-i2c (R35.1), power (5 pins), shift-registers (7 pins), clock-distribution (14 pins)
+5V: management-i2c (R34.1), power (11 pins), adc (L22.1 L24.1), CH11 (L17_CH11.1), CH10 (L17_CH10.1), CH9 (L17_CH9.1), CH8 (L17_CH8.1), CH0 (L17_CH0.1), CH1 (L17_CH1.1), CH2 (L17_CH2.1), CH3 (L17_CH3.1), CH4 (L17_CH4.1), CH5 (L17_CH5.1), CH6 (L17_CH6.1), CH7 (L17_CH7.1)
+7V: management-i2c (R32.1), power (8 pins), adc (L25.1), CH11 (L19_CH11.1), CH10 (L19_CH10.1), CH9 (L19_CH9.1), CH8 (L19_CH8.1), CH0 (L19_CH0.1), CH1 (L19_CH1.1), CH2 (L19_CH2.1), CH3 (L19_CH3.1), CH4 (L19_CH4.1), CH5 (L19_CH5.1), CH6 (L19_CH6.1), CH7 (L19_CH7.1)
+12V_HP: management-i2c (R151.1), power (22 pins)
+VS1: management-i2c (R37.1), power (12 pins), shift-registers (10 pins), CH0 (L18_CH0.1), CH1 (L18_CH1.1), CH2 (L18_CH2.1), CH3 (L18_CH3.1), CH4 (L18_CH4.1), CH5 (L18_CH5.1), CH6 (L18_CH6.1), CH7 (L18_CH7.1)
+VS2: management-i2c (R38.1), power (12 pins), shift-registers (7 pins), CH11 (L18_CH11.1), CH10 (L18_CH10.1), CH9 (L18_CH9.1), CH8 (L18_CH8.1)
-7V: management-i2c (C14.1 R30.1), power (6 pins), adc (L26.1), CH11 (L20_CH11.1), CH10 (L20_CH10.1), CH9 (L20_CH9.1), CH8 (L20_CH8.1), CH0 (L20_CH0.1), CH1 (L20_CH1.1), CH2 (L20_CH2.1), CH3 (L20_CH3.1), CH4 (L20_CH4.1), CH5 (L20_CH5.1), CH6 (L20_CH6.1), CH7 (L20_CH7.1)
GND: rtm-top (R8.2), rtm-connectors (87 pins), management-i2c (55 pins), power (111 pins), shift-registers (51 pins), adc (58 pins), CH11 (42 pins), CH10 (42 pins), CH9 (42 pins), CH8 (42 pins), CH0 (42 pins), CH1 (42 pins), CH2 (42 pins), CH3 (42 pins), CH4 (42 pins), CH5 (42 pins), CH6 (42 pins), CH7 (42 pins), clock-distribution (21 pins)
P3V3MP: rtm-connectors (J1.c2), management-i2c (29 pins), clock-distribution (L1.1 L30.2)
+5V_EN: management-i2c (IC13.7 R25.2), power (IC23.3)
+7V_EN: management-i2c (IC13.6 R23.1), power (IC22.2)
+VS1_EN: management-i2c (IC13.4 R27.2), power (IC16.1)
+VS2_EN: management-i2c (IC13.5 R26.2), power (IC16.8)
-7V_EN: management-i2c (IC13.9 R24.2), power (IC19.2)
~{ADC_CNV_IN}: rtm-connectors (R122.2), clock-distribution (IC43.6)
~{ADC_CNV_OUT}: adc (CNV_ADC1.1 IC38.24 IC39.24), clock-distribution (IC42.4)
ADC_REF_CH0-CH7: adc (IC41.1 IC41.2), CH0 (IC29_CH0.6), CH1 (IC29_CH1.6), CH2 (IC29_CH2.6), CH3 (IC29_CH3.6), CH4 (IC29_CH4.6), CH5 (IC29_CH5.6), CH6 (IC29_CH6.6), CH7 (IC29_CH7.6)
ADC_REF_CH8-CH11: adc (IC41.6 IC41.7), CH11 (IC29_CH11.6), CH10 (IC29_CH10.6), CH9 (IC29_CH9.6), CH8 (IC29_CH8.6)
ADP1850_SYNC: power (IC16.2), clock-distribution (IC12.12)
ADP2370_SYNC: power (IC23.4), clock-distribution (IC12.16)
AIN1_N: adc (C152.2 IC38.19), CH0 (R87_CH0.2)
AIN1_P: adc (C152.1 IC38.20), CH0 (R85_CH0.2)
AIN2_N: adc (C154.2 IC38.16), CH1 (R87_CH1.2)
AIN2_P: adc (C154.1 IC38.17), CH1 (R85_CH1.2)
AIN3_N: adc (C155.2 IC38.13), CH2 (R87_CH2.2)
AIN3_P: adc (C155.1 IC38.14), CH2 (R85_CH2.2)
AIN4_N: adc (C156.2 IC38.10), CH3 (R87_CH3.2)
AIN4_P: adc (C156.1 IC38.11), CH3 (R85_CH3.2)
AIN5_N: adc (C157.2 IC38.4), CH4 (R87_CH4.2)
AIN5_P: adc (C157.1 IC38.5), CH4 (R85_CH4.2)
AIN6_N: adc (C158.2 IC38.1), CH5 (R87_CH5.2)
AIN6_P: adc (C158.1 IC38.2), CH5 (R85_CH5.2)
AIN7_N: adc (C159.2 IC38.50), CH6 (R87_CH6.2)
AIN7_P: adc (C159.1 IC38.51), CH6 (R85_CH6.2)
AIN8_N: adc (C160.2 IC38.47), CH7 (R87_CH7.2)
AIN8_P: adc (C160.1 IC38.48), CH7 (R85_CH7.2)
AIN9_N: adc (C87.2 IC39.13), CH8 (R87_CH8.2)
AIN9_P: adc (C87.1 IC39.14), CH8 (R85_CH8.2)
AIN10_N: adc (C150.2 IC39.10), CH9 (R87_CH9.2)
AIN10_P: adc (C150.1 IC39.11), CH9 (R85_CH9.2)
AIN11_N: adc (C151.2 IC39.4), CH10 (R87_CH10.2)
AIN11_P: adc (C151.1 IC39.5), CH10 (R85_CH10.2)
AIN12_N: adc (C153.2 IC39.1), CH11 (R87_CH11.2)
AIN12_P: adc (C153.1 IC39.2), CH11 (R85_CH11.2)
AMP_EN: shift-registers (IC33.15 R88.1), CH0 (IC26_CH0.8 IC27_CH0.8)
AMP_EN: shift-registers (IC33.1 R89.1), CH1 (IC26_CH1.8 IC27_CH1.8)
AMP_EN: shift-registers (IC33.2 R90.1), CH2 (IC26_CH2.8 IC27_CH2.8)
AMP_EN: shift-registers (IC33.3 R91.1), CH3 (IC26_CH3.8 IC27_CH3.8)
AMP_EN: shift-registers (IC33.4 R92.1), CH4 (IC26_CH4.8 IC27_CH4.8)
AMP_EN: shift-registers (IC33.5 R93.1), CH5 (IC26_CH5.8 IC27_CH5.8)
AMP_EN: shift-registers (IC33.6 R94.1), CH6 (IC26_CH6.8 IC27_CH6.8)
AMP_EN: shift-registers (IC33.7 R95.1), CH7 (IC26_CH7.8 IC27_CH7.8)
AMP_EN: shift-registers (IC37.15 R96.1), CH8 (IC26_CH8.8 IC27_CH8.8)
AMP_EN: shift-registers (IC37.1 R97.1), CH9 (IC26_CH9.8 IC27_CH9.8)
AMP_EN: shift-registers (IC37.2 R98.1), CH10 (IC26_CH10.8 IC27_CH10.8)
AMP_EN: shift-registers (IC37.3 R100.1), CH11 (IC26_CH11.8 IC27_CH11.8)
~{CS_DAC_B0}: rtm-connectors (R123.2), CH0 (IC28_CH0.7), CH1 (IC28_CH1.7), CH2 (IC28_CH2.7), CH3 (IC28_CH3.7)
~{CS_DAC_B1}: rtm-connectors (R120.2), CH4 (IC28_CH4.7), CH5 (IC28_CH5.7), CH6 (IC28_CH6.7), CH7 (IC28_CH7.7)
~{CS_DAC_B2}: rtm-connectors (R117.2), CH11 (IC28_CH11.7), CH10 (IC28_CH10.7), CH9 (IC28_CH9.7), CH8 (IC28_CH8.7)
CH0_L: CH0 (R83_CH0.I1), output-connectors (J4.1)
CH0_R: CH0 (5 pins), output-connectors (J4.2)
CH1_L: CH1 (R83_CH1.I1), output-connectors (J4.3)
CH1_R: CH1 (5 pins), output-connectors (J4.4)
CH2_L: CH2 (R83_CH2.I1), output-connectors (J4.5)
CH2_R: CH2 (5 pins), output-connectors (J4.6)
CH3_L: CH3 (R83_CH3.I1), output-connectors (J4.7)
CH3_R: CH3 (5 pins), output-connectors (J4.8)
CH4_L: CH4 (R83_CH4.I1), output-connectors (J7.1)
CH4_R: CH4 (5 pins), output-connectors (J7.2)
CH5_L: CH5 (R83_CH5.I1), output-connectors (J7.3)
CH5_R: CH5 (5 pins), output-connectors (J7.4)
CH6_L: CH6 (R83_CH6.I1), output-connectors (J7.5)
CH6_R: CH6 (5 pins), output-connectors (J7.6)
CH7_L: CH7 (R83_CH7.I1), output-connectors (J7.7)
CH7_R: CH7 (5 pins), output-connectors (J7.8)
CH8_L: CH8 (R83_CH8.I1), output-connectors (J5.1)
CH8_R: CH8 (5 pins), output-connectors (J5.2)
CH9_L: CH9 (R83_CH9.I1), output-connectors (J5.3)
CH9_R: CH9 (5 pins), output-connectors (J5.4)
CH10_L: CH10 (R83_CH10.I1), output-connectors (J5.5)
CH10_R: CH10 (5 pins), output-connectors (J5.6)
CH11_L: CH11 (R83_CH11.I1), output-connectors (J5.7)
CH11_R: CH11 (5 pins), output-connectors (J5.8)
CLK_DAC_B0: rtm-connectors (R114.2), CH0 (IC28_CH0.8), CH1 (IC28_CH1.8), CH2 (IC28_CH2.8), CH3 (IC28_CH3.8)
CLK_DAC_B1: rtm-connectors (R111.2), CH4 (IC28_CH4.8), CH5 (IC28_CH5.8), CH6 (IC28_CH6.8), CH7 (IC28_CH7.8)
CLK_DAC_B2: rtm-connectors (R1.2), CH11 (IC28_CH11.8), CH10 (IC28_CH10.8), CH9 (IC28_CH9.8), CH8 (IC28_CH8.8)
CLKOUT_OCTO_N: rtm-connectors (J1.f8), adc (IC38.34)
CLKOUT_OCTO_P: rtm-connectors (J1.e8), adc (IC38.33)
CLKOUT_QUAD_N: rtm-connectors (J1.b6), adc (IC39.34)
CLKOUT_QUAD_P: rtm-connectors (J1.a6), adc (IC39.33)
~{DAC_LDAC_IN}: rtm-connectors (R125.2), clock-distribution (IC10.6)
DAC_REF_CH0-CH7: power (DACREF1.1 IC18.6 IC18.7), CH0 (L16_CH0.2), CH1 (L16_CH1.2), CH2 (L16_CH2.2), CH3 (L16_CH3.2), CH4 (L16_CH4.2), CH5 (L16_CH5.2), CH6 (L16_CH6.2), CH7 (L16_CH7.2)
DAC_REF_CH8-CH11: power (DACREF2.1 IC18.1 IC18.2), CH11 (L16_CH11.2), CH10 (L16_CH10.2), CH9 (L16_CH9.2), CH8 (L16_CH8.2)
I2C_SCL_MMC: rtm-connectors (J1.d2), management-i2c (8 pins), clock-distribution (IC12.10)
I2C_SDA_MMC: rtm-connectors (J1.d1), management-i2c (8 pins), clock-distribution (IC12.9)
IFLAG_L: shift-registers (IC30.11), CH0 (IC26_CH0.4)
IFLAG_L: shift-registers (IC30.3), CH1 (IC26_CH1.4)
IFLAG_L: shift-registers (IC31.11), CH4 (IC26_CH4.4)
IFLAG_L: shift-registers (IC31.3), CH5 (IC26_CH5.4)
IFLAG_L: shift-registers (IC32.11), CH8 (IC26_CH8.4)
IFLAG_L: shift-registers (IC32.3), CH9 (IC26_CH9.4)
IFLAG_L: shift-registers (IC34.11), CH2 (IC26_CH2.4)
IFLAG_L: shift-registers (IC34.3), CH3 (IC26_CH3.4)
IFLAG_L: shift-registers (IC35.11), CH6 (IC26_CH6.4)
IFLAG_L: shift-registers (IC35.3), CH7 (IC26_CH7.4)
IFLAG_L: shift-registers (IC36.11), CH10 (IC26_CH10.4)
IFLAG_L: shift-registers (IC36.3), CH11 (IC26_CH11.4)
IFLAG_R: shift-registers (IC30.13), CH0 (IC27_CH0.4)
IFLAG_R: shift-registers (IC30.5), CH1 (IC27_CH1.4)
IFLAG_R: shift-registers (IC31.13), CH4 (IC27_CH4.4)
IFLAG_R: shift-registers (IC31.5), CH5 (IC27_CH5.4)
IFLAG_R: shift-registers (IC32.13), CH8 (IC27_CH8.4)
IFLAG_R: shift-registers (IC32.5), CH9 (IC27_CH9.4)
IFLAG_R: shift-registers (IC34.13), CH2 (IC27_CH2.4)
IFLAG_R: shift-registers (IC34.5), CH3 (IC27_CH3.4)
IFLAG_R: shift-registers (IC35.13), CH6 (IC27_CH6.4)
IFLAG_R: shift-registers (IC35.5), CH7 (IC27_CH7.4)
IFLAG_R: shift-registers (IC36.13), CH10 (IC27_CH10.4)
IFLAG_R: shift-registers (IC36.5), CH11 (IC27_CH11.4)
~{LDAC_B0}: CH0 (IC28_CH0.11), CH1 (IC28_CH1.11), CH2 (IC28_CH2.11), CH3 (IC28_CH3.11), clock-distribution (IC9.4)
~{LDAC_B1}: CH4 (IC28_CH4.11), CH5 (IC28_CH5.11), CH6 (IC28_CH6.11), CH7 (IC28_CH7.11), clock-distribution (IC11.4)
~{LDAC_B2}: CH11 (IC28_CH11.11), CH10 (IC28_CH10.11), CH9 (IC28_CH9.11), CH8 (IC28_CH8.11), clock-distribution (IC40.4)
LT8364_SYNC: power (IC19.10), clock-distribution (IC12.15)
P30_IO5_CD_B1_N: rtm-connectors (J1.d5), shift-registers (T5.1 T7.1)
P31_IO3_AB_B2_N: rtm-connectors (J2.b3), adc (IC39.36)
P31_IO3_AB_B2_P: rtm-connectors (J2.a3), adc (IC39.35)
P31_IO4_AB_B2_N: rtm-connectors (J2.b4), adc (IC39.28)
P31_IO4_AB_B2_P: rtm-connectors (J2.a4), adc (IC39.27)
RTM_LVD1_N: rtm-connectors (J1.f7), adc (IC38.36)
RTM_LVD1_P: rtm-connectors (J1.e7), adc (IC38.35)
RTM_LVD2_N: rtm-connectors (J1.f6), adc (IC38.40)
RTM_LVD2_P: rtm-connectors (J1.e6), adc (IC38.39)
RTM_LVD3_N: rtm-connectors (J1.f5), adc (IC38.42 R103.2)
RTM_LVD3_P: rtm-connectors (J1.e5), adc (IC38.41 R103.1)
RTM_LVD4_N: rtm-connectors (J1.b5), adc (IC39.42 R104.2)
RTM_LVD4_P: rtm-connectors (J1.a5), adc (IC39.41 R104.1)
RTM_LVD5_N: rtm-connectors (J1.f9), adc (IC38.30)
RTM_LVD5_P: rtm-connectors (J1.e9), adc (IC38.29)
RTM_LVD6_N: rtm-connectors (J1.f10), adc (IC38.28)
RTM_LVD6_P: rtm-connectors (J1.e10), adc (IC38.27)
~{SHIFT_OE}: rtm-connectors (R113.2), shift-registers (IC33.13 IC37.13)
SDI_DAC_CH0: rtm-connectors (R130.2), CH0 (IC28_CH0.10)
SDI_DAC_CH1: rtm-connectors (R127.2), CH1 (IC28_CH1.10)
SDI_DAC_CH2: rtm-connectors (R124.2), CH2 (IC28_CH2.10)
SDI_DAC_CH3: rtm-connectors (R121.2), CH3 (IC28_CH3.10)
SDI_DAC_CH4: rtm-connectors (R118.2), CH4 (IC28_CH4.10)
SDI_DAC_CH5: rtm-connectors (R115.2), CH5 (IC28_CH5.10)
SDI_DAC_CH6: rtm-connectors (R112.2), CH6 (IC28_CH6.10)
SDI_DAC_CH7: rtm-connectors (R2.2), CH7 (IC28_CH7.10)
SDI_DAC_CH8: rtm-connectors (R128.2), CH8 (IC28_CH8.10)
SDI_DAC_CH9: rtm-connectors (R119.2), CH9 (IC28_CH9.10)
SDI_DAC_CH10: rtm-connectors (R129.2), CH10 (IC28_CH10.10)
SDI_DAC_CH11: rtm-connectors (R126.2), CH11 (IC28_CH11.10)
SHIFT_CLK: rtm-connectors (R131.2), shift-registers (IC33.11 IC37.11 T4.1 T6.1)
SHIFT_DIN: rtm-connectors (R110.2), shift-registers (IC33.14)
SHIFT_DOUT: rtm-connectors (IC8.4), shift-registers (R109.1 T8.3)
SHIFT_STR: rtm-connectors (R116.2), shift-registers (IC33.12 IC37.12)
SYNC_CLK1_N: rtm-connectors (J1.b3), clock-distribution (C140.2)
SYNC_CLK1_P: rtm-connectors (J1.a3), clock-distribution (C139.2)
TFLAG_L: shift-registers (IC30.12), CH0 (IC26_CH0.7)
TFLAG_L: shift-registers (IC30.4), CH1 (IC26_CH1.7)
TFLAG_L: shift-registers (IC31.12), CH4 (IC26_CH4.7)
TFLAG_L: shift-registers (IC31.4), CH5 (IC26_CH5.7)
TFLAG_L: shift-registers (IC32.12), CH8 (IC26_CH8.7)
TFLAG_L: shift-registers (IC32.4), CH9 (IC26_CH9.7)
TFLAG_L: shift-registers (IC34.12), CH2 (IC26_CH2.7)
TFLAG_L: shift-registers (IC34.4), CH3 (IC26_CH3.7)
TFLAG_L: shift-registers (IC35.12), CH6 (IC26_CH6.7)
TFLAG_L: shift-registers (IC35.4), CH7 (IC26_CH7.7)
TFLAG_L: shift-registers (IC36.12), CH10 (IC26_CH10.7)
TFLAG_L: shift-registers (IC36.4), CH11 (IC26_CH11.7)
TFLAG_R: shift-registers (IC30.14), CH0 (IC27_CH0.7)
TFLAG_R: shift-registers (IC30.6), CH1 (IC27_CH1.7)
TFLAG_R: shift-registers (IC31.14), CH4 (IC27_CH4.7)
TFLAG_R: shift-registers (IC31.6), CH5 (IC27_CH5.7)
TFLAG_R: shift-registers (IC32.14), CH8 (IC27_CH8.7)
TFLAG_R: shift-registers (IC32.6), CH9 (IC27_CH9.7)
TFLAG_R: shift-registers (IC34.14), CH2 (IC27_CH2.7)
TFLAG_R: shift-registers (IC34.6), CH3 (IC27_CH3.7)
TFLAG_R: shift-registers (IC35.14), CH6 (IC27_CH6.7)
TFLAG_R: shift-registers (IC35.6), CH7 (IC27_CH7.7)
TFLAG_R: shift-registers (IC36.14), CH10 (IC27_CH10.7)
TFLAG_R: shift-registers (IC36.6), CH11 (IC27_CH11.7)